# EasyEDA Pro project firefly_rp2040.eprj, schematic Schematic2
Board Name: test-jig; Create Date: 2026-09-05; Page Name: P1; Project Name: firefly_rp2040; Schematic Name: Schematic2; Update Date: 2026-09-08; Company: EasyEDA.com; Page Size: A4; Version: V1.0
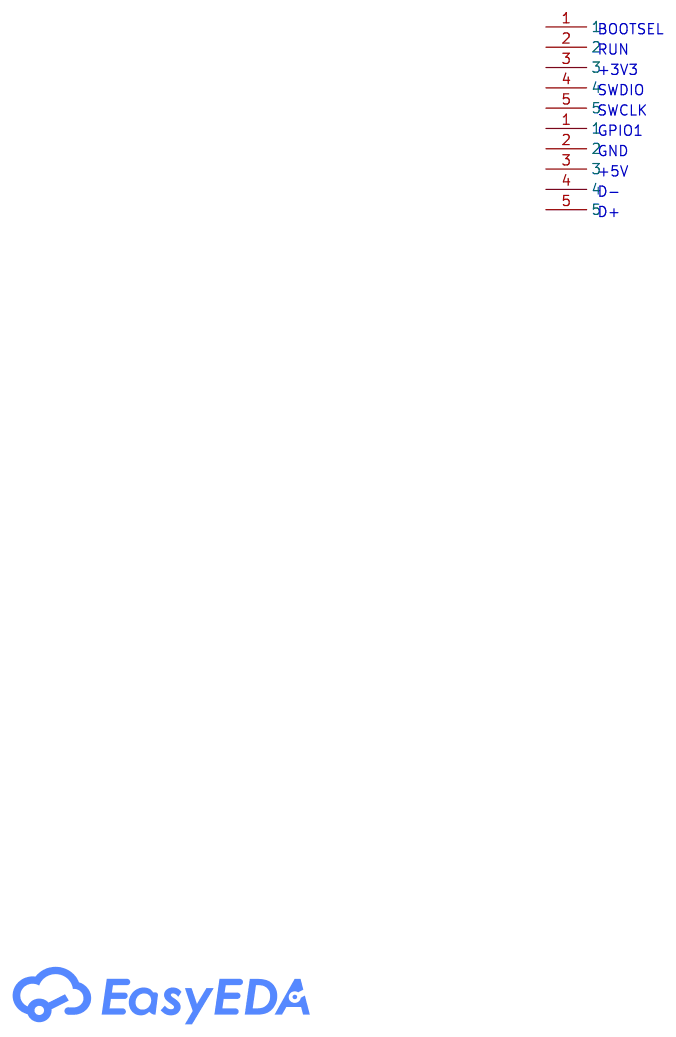
[diagram p2: schematic sheet]

## Parts
U1  -  [5-pin Pogo]
U2  -  [5-pin Pogo]

## Library data of the parts
U1 U2 = 5-pin Pogo

## Nets

Not connected (* = marked no-connect by the designer): U1 1 2 3 4 5; U2 1 2 3 4 5

## Notes on the sheet
- BOOTSEL
- RUN
- +3V3
- SWDIO
- SWCLK
- GPIO1
- +5V
- GND
- D-
- D+
